# Altium schematic sheet Control_Moway.SchDoc: Control Moway
size A3; Revision: V2; SheetNumber: 2; SheetTotal: 3
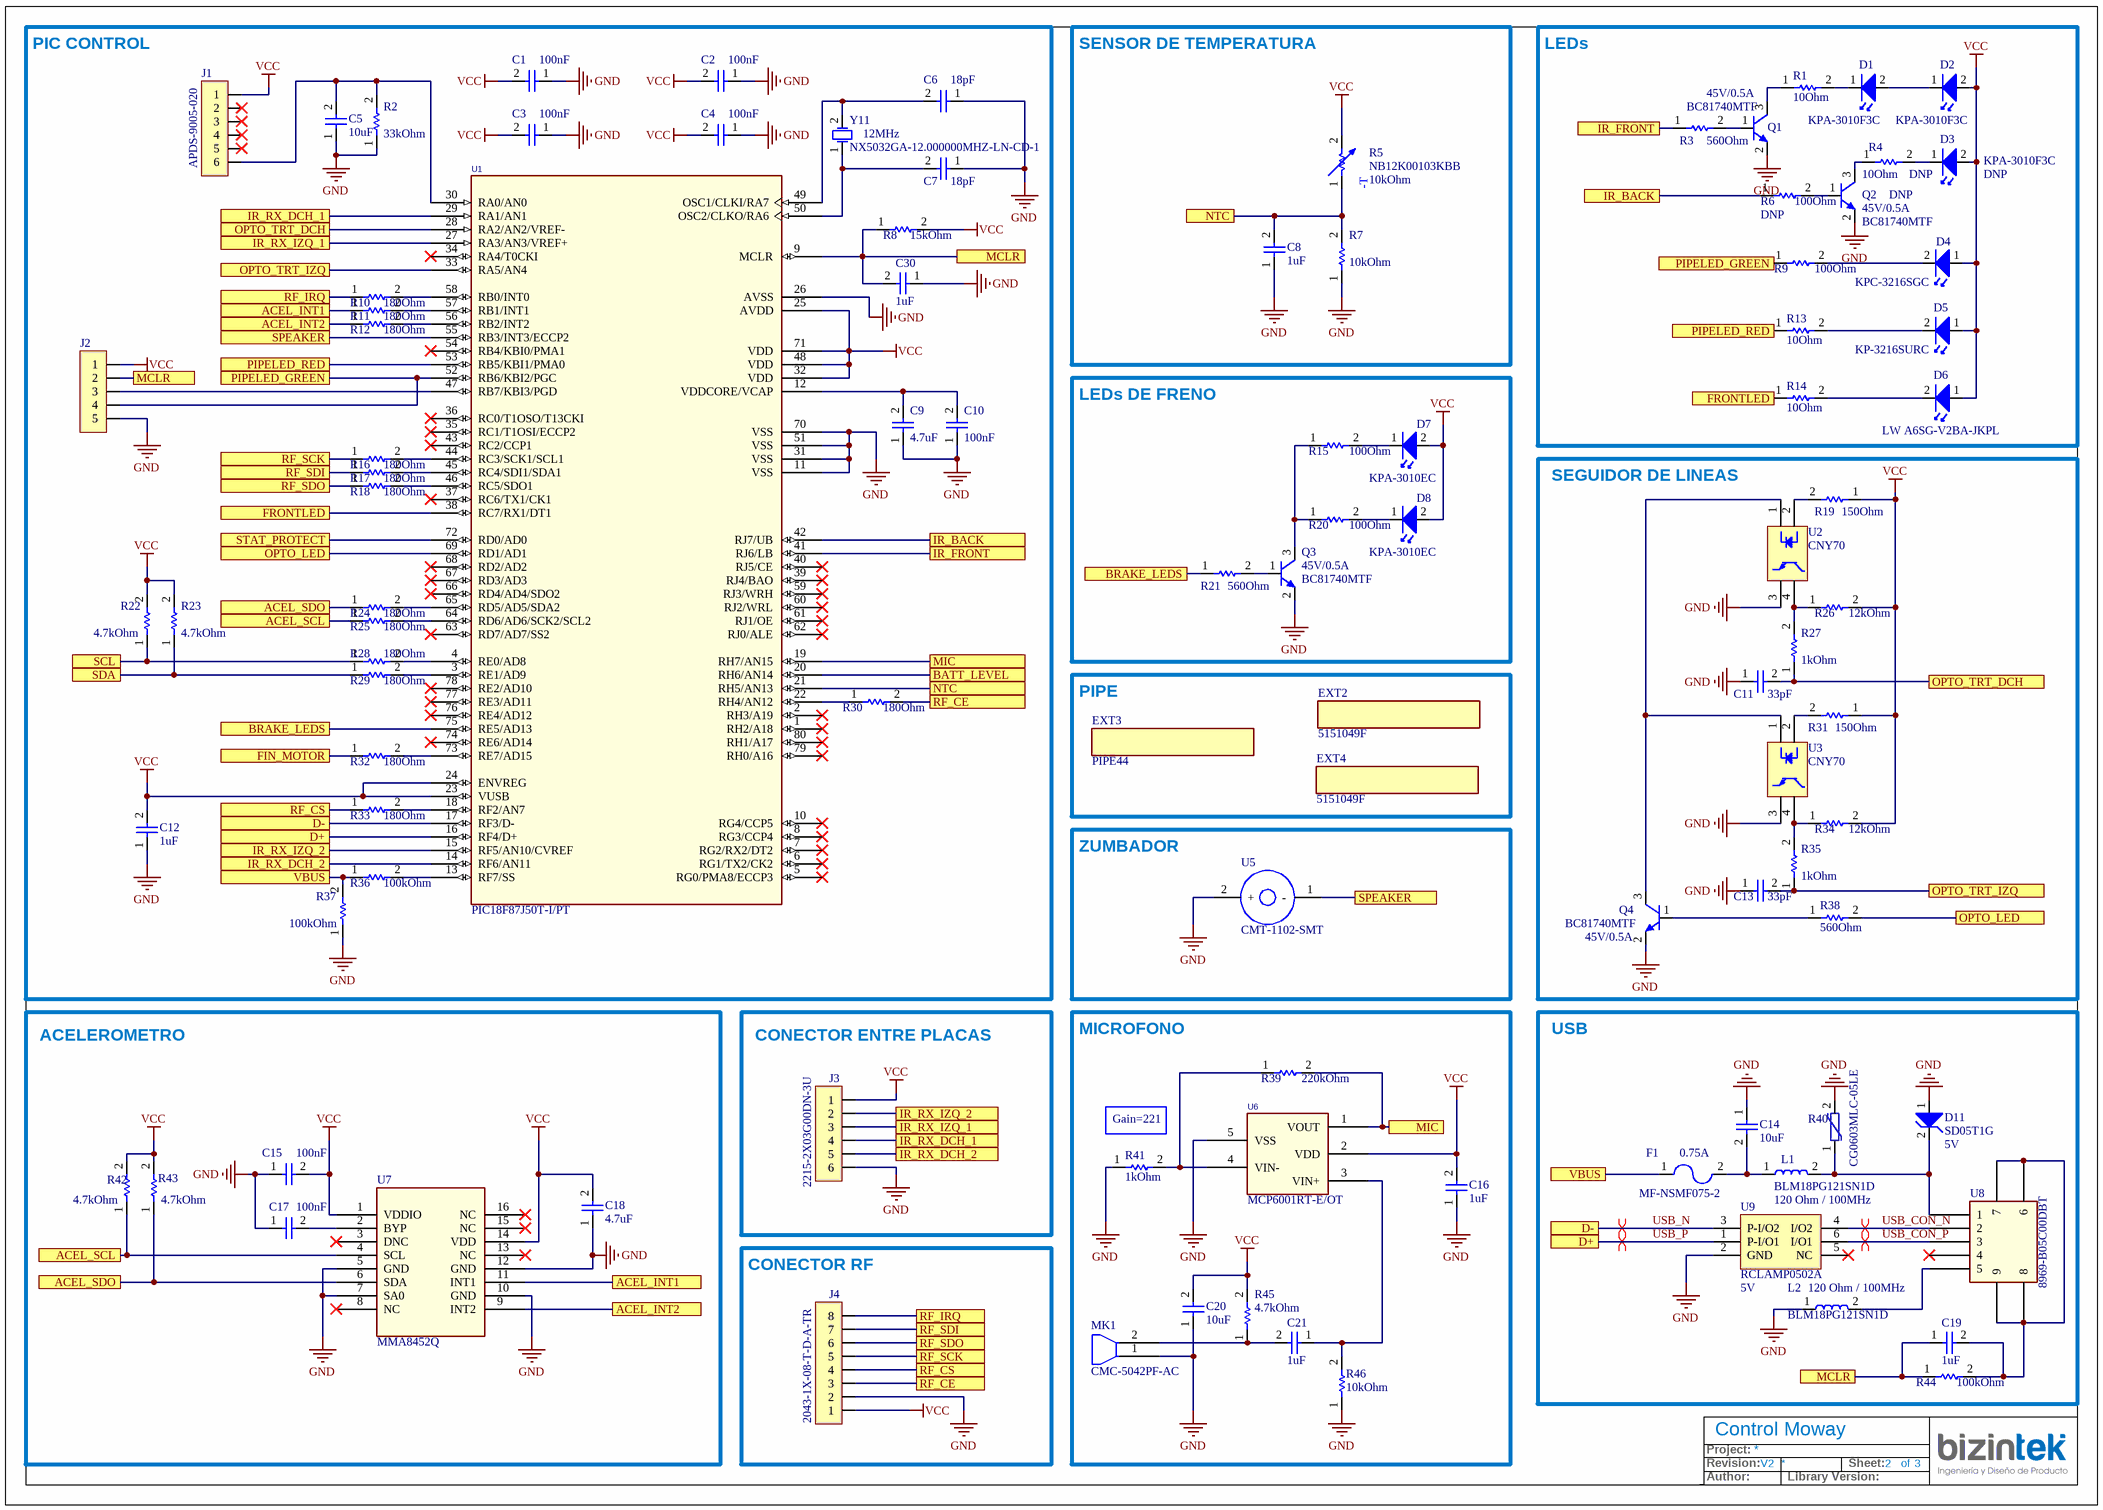
[diagram p0: Control_Moway.SchDoc]

## Parts
C1  value 100nF  [C0402]  (hidden comment: C100NV10X7R0402)
C2  value 100nF  [C0402]  (hidden comment: C100NV10X7R0402)
C3  value 100nF  [C0402]  (hidden comment: C100NV10X7R0402)
C4  value 100nF  [C0402]  (hidden comment: C100NV10X7R0402)
C5  value 10uF  [C0603]  (hidden comment: C10UV10X5R0603)
C6  value 18pF  [C0402]  (hidden comment: C18PV10C0G0402)
C7  value 18pF  [C0402]  (hidden comment: C18PV10C0G0402)
C8  value 1uF  [C0402]  (hidden comment: C1UV10X5R0402)
C9  value 4.7uF  [C0402]  (hidden comment: C4U7V10X5R0402)
C10  value 100nF  [C0402]  (hidden comment: C100NV10X7R0402)
C11  value 33pF  [C0603]  (hidden comment: C33PV10C0G0603)
C12  value 1uF  [C0402]  (hidden comment: C1UV10X5R0402)
C13  value 33pF  [C0603]  (hidden comment: C33PV10C0G0603)
C14  value 10uF  [C0603]  (hidden comment: C10UV10X5R0603)
C15  value 100nF  [C0402]  (hidden comment: C100NV10X7R0402)
C16  value 1uF  [C0402]  (hidden comment: C1UV10X5R0402)
C17  value 100nF  [C0402]  (hidden comment: C100NV10X7R0402)
C18  value 4.7uF  [C0402]  (hidden comment: C4U7V10X5R0402)
C19  value 1uF  [C0402]  (hidden comment: C1UV10X5R0402)
C20  value 10uF  [C0603]  (hidden comment: C10UV10X5R0603)
C21  value 1uF  [C0402]  (hidden comment: C1UV10X5R0402)
C30  value 1uF  [C0402]  (hidden comment: C1UV10X5R0402)
D1  Manufacturer Part Number: KPA-3010F3C  [KPA3010]  (hidden comment: KPA3010F3C)
D2  Manufacturer Part Number: KPA-3010F3C  [KPA3010]  (hidden comment: KPA3010F3C)
D3  DNP  Manufacturer Part Number: KPA-3010F3C  [KPA3010F3C_MOWAY]
D4  Manufacturer Part Number: KPC-3216SGC  [LED1206G]  (hidden comment: KPC3216SGC)
D5  Manufacturer Part Number: KP-3216SURC  [LED1206]  (hidden comment: KP3216SURC)
D6  Manufacturer Part Number: LW A6SG-V2BA-JKPL  [LWA6SG]  (hidden comment: LWA6SGV2BAJKPL)
D7  Manufacturer Part Number: KPA-3010EC  [KPA3010]  (hidden comment: KPA3010EC)
D8  Manufacturer Part Number: KPA-3010EC  [KPA3010]  (hidden comment: KPA3010EC)
D11  value 5V  [SOD323_ONSEMI]  (hidden comment: SD05T1G)
EXT2  5151049F  [5151049F]
EXT3  PIPE44  [PIPE44_MR]
EXT4  5151049F  [5151049F]
F1  value 0.75A  Manufacturer Part Number: MF-NSMF075-2  [F1206]  (hidden comment: MFNSMF0752)
J1  Manufacturer Part Number: APDS-9005-020  [APDS9005020]  (hidden comment: APDS9005020)
J2  PAD_5PIN_TH_2X1MM_1.5MM_PITCH  [PAD_5PIN_TH_2X1MM_1.5MM_PITCH]  (value not drawn)  (no BOM)
J3  Manufacturer Part Number: 2215-2X03G00DN-3U  [22152X03_OUPIIN]  (hidden comment: 2215203G00DN3U)
J4  Manufacturer Part Number: 2043-1X-08-T-D-A-TR  [20431X08TDATR_OUPIIN]  (hidden comment: 20431X08TDATR)
L1  value 120 Ohm / 100MHz  [L0603]  (hidden comment: BLM18PG121SN1D)
L2  value 120 Ohm / 100MHz  [L0603]  (hidden comment: BLM18PG121SN1D)
MK1  Manufacturer Part Number: CMC-5042PF-AC  [CMC5042PFAC]  (hidden comment: CMC5042PFAC)
Q1  value 45V/0.5A  [SOT23_FAIRCHILD]  (hidden comment: BC81740MTF)
Q2  DNP  value 45V/0.5A  Manufacturer Part Number: BC81740MTF  [SOT23_FAIRCHILD]
Q3  value 45V/0.5A  [SOT23_FAIRCHILD]  (hidden comment: BC81740MTF)
Q4  value 45V/0.5A  [SOT23_FAIRCHILD]  (hidden comment: BC81740MTF)
R1  value 10Ohm  [R0402]  (hidden comment: R10T10402)
R2  value 33kOhm  [R0402]  (hidden comment: R33KT10402)
R3  value 560Ohm  [R0402]  (hidden comment: R560T10402)
R4  DNP  value 10Ohm  [R0402]
R5  value 10kOhm  [R0805]  (hidden comment: NB12K00103KBB)
R6  DNP  value 100Ohm  [R0402]
R7  value 10kOhm  [R0402]  (hidden comment: R10KT10402)
R8  value 15kOhm  [R0402]  (hidden comment: R15KT10402)
R9  value 100Ohm  [R0402]  (hidden comment: R100T10402)
R10  value 180Ohm  [R0402]  (hidden comment: R180T10402)
R11  value 180Ohm  [R0402]  (hidden comment: R180T10402)
R12  value 180Ohm  [R0402]  (hidden comment: R180T10402)
R13  value 10Ohm  [R0402]  (hidden comment: R10T10402)
R14  value 10Ohm  [R0402]  (hidden comment: R10T10402)
R15  value 100Ohm  [R0402]  (hidden comment: R100T10402)
R16  value 180Ohm  [R0402]  (hidden comment: R180T10402)
R17  value 180Ohm  [R0402]  (hidden comment: R180T10402)
R18  value 180Ohm  [R0402]  (hidden comment: R180T10402)
R19  value 150Ohm  [R0402]  (hidden comment: R150T10402)
R20  value 100Ohm  [R0402]  (hidden comment: R100T10402)
R21  value 560Ohm  [R0402]  (hidden comment: R560T10402)
R22  value 4.7kOhm  [R0402]  (hidden comment: R4K7T10402)
R23  value 4.7kOhm  [R0402]  (hidden comment: R4K7T10402)
R24  value 180Ohm  [R0402]  (hidden comment: R180T10402)
R25  value 180Ohm  [R0402]  (hidden comment: R180T10402)
R26  value 12kOhm  [R0402]  (hidden comment: R12KT10402)
R27  value 1kOhm  [R0402]  (hidden comment: R1KT10402)
R28  value 180Ohm  [R0402]  (hidden comment: R180T10402)
R29  value 180Ohm  [R0402]  (hidden comment: R180T10402)
R30  value 180Ohm  [R0402]  (hidden comment: R180T10402)
R31  value 150Ohm  [R0402]  (hidden comment: R150T10402)
R32  value 180Ohm  [R0402]  (hidden comment: R180T10402)
R33  value 180Ohm  [R0402]  (hidden comment: R180T10402)
R34  value 12kOhm  [R0402]  (hidden comment: R12KT10402)
R35  value 1kOhm  [R0402]  (hidden comment: R1KT10402)
R36  value 100kOhm  [R0402]  (hidden comment: R100KT10402)
R37  value 100kOhm  [R0402]  (hidden comment: R100KT10402)
R38  value 560Ohm  [R0402]  (hidden comment: R560T10402)
R39  value 220kOhm  [R0402]  (hidden comment: R220KT10402)
R40  Manufacturer Part Number: CG0603MLC-05LE  [V0603]  (hidden comment: CG0603MLC05LE)
R41  value 1kOhm  [R0402]  (hidden comment: R1KT10402)
R42  value 4.7kOhm  [R0402]  (hidden comment: R4K7T10402)
R43  value 4.7kOhm  [R0402]  (hidden comment: R4K7T10402)
R44  value 100kOhm  [R0402]  (hidden comment: R100KT10402)
R45  value 4.7kOhm  [R0402]  (hidden comment: R4K7T10402)
R46  value 10kOhm  [R0402]  (hidden comment: R10KT10402)
U1  Manufacturer Part Number: PIC18F87J50T-I/PT  [TQFP80_MCP]  (hidden comment: PIC18F87J50TIPT)
U2  CNY70
U3  CNY70
U5  Manufacturer Part Number: CMT-1102-SMT  [CMT1102SMT]  (hidden comment: CMT1102SMT)
U6  Manufacturer Part Number: MCP6001RT-E/OT  [SOT23-5_MCP]  (hidden comment: MCP6001RTEOT)
U7  MMA8452Q  [QFN16-5x3_NXP]
U8  Manufacturer Part Number: 8969-B05C00DBT  [8969B05C00DBT_OUPIIN]  (hidden comment: 8969B05C00DBT)
U9  value 5V  [SOT666_SEMTECH]  (hidden comment: RCLAMP0502A)
Y11  value 12MHz  Manufacturer Part Number: NX5032GA-12.000000MHZ-LN-CD-1  [NX5032GA_NDK]  (hidden comment: NX5032GA12MHZLNCD1)

## Blocks framed on the sheet
PIC CONTROL: C1-C7 C9 C10 C12 C30 J1 J2 R2 R8 R10-R12 R16-R18 R22-R25 R28-R30 R32 R33 R36 R37 U1 Y11
SENSOR DE TEMPERATURA: C8 R5 R7
LEDs: D1-D6 Q1 Q2 R1 R3 R4 R6 R9 R13 R14
LEDs DE FRENO: D7 D8 Q3 R15 R20 R21
SEGUIDOR DE LINEAS: C11 C13 Q4 R19 R26 R27 R31 R34 R35 R38 U2 U3
PIPE: EXT2-EXT4
ZUMBADOR: U5
ACELEROMETRO: C15 C17 C18 R42 R43 U7
CONECTOR ENTRE PLACAS: J3
MICROFONO: C16 C20 C21 MK1 R39 R41 R45 R46 U6
USB: C14 C19 D11 F1 L1 L2 R40 R44 U8 U9
CONECTOR RF: J4

## Ports
ACEL_INT1, ACEL_INT2, ACEL_SCL, ACEL_SDO, BATT_LEVEL, BRAKE_LEDS, D+, D-, FIN_MOTOR, FRONTLED, IR_BACK, IR_FRONT, IR_RX_DCH_1, IR_RX_DCH_2, IR_RX_IZQ_1, IR_RX_IZQ_2, MCLR, MIC, NTC, OPTO_LED, OPTO_TRT_DCH, OPTO_TRT_IZQ, PIPELED_GREEN, PIPELED_RED, RF_CE, RF_CS, RF_IRQ, RF_SCK, RF_SDI, RF_SDO, SCL, SDA, SPEAKER, STAT_PROTECT, VBUS

## Nets
GND: C1.1 C2.1 C3.1 C4.1 C5.1 C6.1 C7.1 C8.1 C9.1 C10.1 C11.1 C12.1 C13.1 C14.1 C15.1 C16.1 C17.1 C18.1 C20.1 C30.1 D11.1(A) J2.5 J3.6 J4.2 L2.1 MK1.1 Q1.2(E) Q2.2(E) Q3.2(E) Q4.2(E) R2.1 R7.1 R37.1 R40.2 R41.1 R46.1 U1.11(VSS) U1.26(AVSS) U1.31(VSS) U1.51(VSS) U1.70(VSS) U2.3(S') U3.3(S') U5.2(+) U6.5(VSS) U7.5(GND) U7.7(SA0) U7.10(GND) U7.12(GND) U9.2(GND)
VCC: C1.2 C2.2 C3.2 C4.2 C12.2 C15.2 C16.2 C18.2 C20.2 D2.2(A) D3.2(A) D4.1(A) D5.1(A) D6.1(A) D7.2(A) D8.2(A) J1.1 J2.1 J3.1 J4.1 R5.2 R8.2 R19.1 R22.2 R23.2 R26.2 R31.1 R34.2 R42.2 R43.2 R45.2 U1.23(VUSB) U1.24(ENVREG) U1.25(AVDD) U1.32(VDD) U1.48(VDD) U1.71(VDD) U6.2(VDD) U7.1(VDDIO) U7.14(VDD)
ACEL_INT1: R11.1 U7.11(INT1) ; port ACEL_INT1
ACEL_INT2: R12.1 U7.9(INT2) ; port ACEL_INT2
ACEL_SCL: R25.1 R42.1 U7.4(SCL) ; port ACEL_SCL
ACEL_SDO: R24.1 R43.1 U7.6(SDA) ; port ACEL_SDO
BATT_LEVEL: U1.20(RH6/AN14) ; port BATT_LEVEL
BRAKE_LEDS: R21.1 U1.75(RE5/AD13) ; port BRAKE_LEDS
FIN_MOTOR: R32.1 ; port FIN_MOTOR
FRONTLED: R14.1 U1.38(RC7/RX1/DT1) ; port FRONTLED
IR_BACK: R6.1 U1.42(RJ7/UB) ; port IR_BACK
IR_FRONT: R3.1 U1.41(RJ6/LB) ; port IR_FRONT
IR_RX_DCH_1: J3.4 U1.29(RA1/AN1) ; port IR_RX_DCH_1
IR_RX_DCH_2: J3.5 U1.14(RF6/AN11) ; port IR_RX_DCH_2
IR_RX_IZQ_1: J3.3 U1.27(RA3/AN3/VREF+) ; port IR_RX_IZQ_1
IR_RX_IZQ_2: J3.2 U1.15(RF5/AN10/CVREF) ; port IR_RX_IZQ_2
MCLR: C19.1 C30.2 J2.2 R8.1 R44.1 U1.9(MCLR) ; port MCLR
MIC: R39.2 U1.19(RH7/AN15) U6.1(VOUT) ; port MIC
NTC: C8.2 R5.1 R7.2 U1.21(RH5/AN13) ; port NTC
OPTO_LED: R38.2 U1.69(RD1/AD1) ; port OPTO_LED
OPTO_TRT_DCH: C11.2 R27.1 U1.28(RA2/AN2/VREF-) ; port OPTO_TRT_DCH
OPTO_TRT_IZQ: C13.2 R35.1 U1.33(RA5/AN4) ; port OPTO_TRT_IZQ
PIPELED_GREEN: J2.4 R9.1 U1.52(RB6/KBI2/PGC) ; port PIPELED_GREEN
PIPELED_RED: R13.1 U1.53(RB5/KBI1/PMA0) ; port PIPELED_RED
RF_CE: J4.3 R30.2 ; port RF_CE
RF_CS: J4.4 R33.1 ; port RF_CS
RF_IRQ: J4.8 R10.1 ; port RF_IRQ
RF_SCK: J4.5 R16.1 ; port RF_SCK
RF_SDI: J4.7 R17.1 ; port RF_SDI
RF_SDO: J4.6 R18.1 ; port RF_SDO
SCL: R22.1 R28.1 ; port SCL
SDA: R23.1 R29.1 ; port SDA
SPEAKER: U1.55(RB3/INT3/ECCP2) U5.1(-) ; port SPEAKER
STAT_PROTECT: U1.72(RD0/AD0) ; port STAT_PROTECT
USB_CON_N: U8.2 U9.4(I/O2)
USB_CON_P: U8.3 U9.6(I/O1)
USB_N: U1.17(RF3/D-) U9.3(P-I/O2) ; port D-
USB_P: U1.16(RF4/D+) U9.1(P-I/O1) ; port D+
VBUS: F1.1 R36.1 R37.2 ; port VBUS
NetC5_2: C5.2 J1.6 R2.2 U1.30(RA0/AN0)
NetC6_2: C6.2 U1.49(OSC1/CLKI/RA7) Y11.2(OSC2)
NetC7_2: C7.2 U1.50(OSC2/CLKO/RA6) Y11.1(OSC1)
NetC9_2: C9.2 C10.2 U1.12(VDDCORE/VCAP)
NetC14_2: C14.2 F1.2 L1.1
NetC17_2: C17.2 U7.2(BYP)
NetC19_2: C19.2 R44.2 U8.6 U8.7 U8.8 U8.9
NetC21_1: C21.1 R46.2 U6.3(VIN+)
NetC21_2: C21.2 MK1.2 R45.1
NetD1_1: D1.1(K) R1.2
NetD1_2: D1.2(A) D2.1(K)
NetD3_1: D3.1(K) R4.2
NetD4_2: D4.2(K) R9.2
NetD5_2: D5.2(K) R13.2
NetD6_2: D6.2(K) R14.2
NetD7_1: D7.1(K) R15.2
NetD8_1: D8.1(K) R20.2
NetD11_2: D11.2 L1.2 R40.1 U8.1
NetJ2_3: J2.3 U1.47(RB7/KBI3/PGD)
NetL2_2: L2.2 U8.5
NetQ1_1: Q1.1(B) R3.2
NetQ1_3: Q1.3(C) R1.1
NetQ2_1: Q2.1(B) R6.2
NetQ2_3: Q2.3(C) R4.1
NetQ3_1: Q3.1(B) R21.2
NetQ3_3: Q3.3(C) R15.1 R20.1
NetQ4_1: Q4.1(B) R38.1
NetQ4_3: Q4.3(C) U2.1(LEDA) U3.1(LEDA)
NetR10_2: R10.2 U1.58(RB0/INT0)
NetR11_2: R11.2 U1.57(RB1/INT1)
NetR12_2: R12.2 U1.56(RB2/INT2)
NetR16_2: R16.2 U1.44(RC3/SCK1/SCL1)
NetR17_2: R17.2 U1.45(RC4/SDI1/SDA1)
NetR18_2: R18.2 U1.46(RC5/SDO1)
NetR19_2: R19.2 U2.2
NetR24_2: R24.2 U1.65(RD5/AD5/SDA2)
NetR25_2: R25.2 U1.64(RD6/AD6/SCK2/SCL2)
NetR26_1: R26.1 R27.2 U2.4
NetR28_2: R28.2 U1.4(RE0/AD8)
NetR29_2: R29.2 U1.3(RE1/AD9)
NetR30_1: R30.1 U1.22(RH4/AN12)
NetR31_2: R31.2 U3.2
NetR32_2: R32.2 U1.73(RE7/AD15)
NetR33_2: R33.2 U1.18(RF2/AN7)
NetR34_1: R34.1 R35.2 U3.4
NetR36_2: R36.2 U1.13(RF7/SS)
NetR39_1: R39.1 R41.2 U6.4(VIN-)

Not connected (* = marked no-connect by the designer): J1 2* 3* 4* 5*; U1 1(RH2/A18)* 2(RH3/A19)* 5(RG0/PMA8/ECCP3)* 6(RG1/TX2/CK2)* 7(RG2/RX2/DT2)* 8(RG3/CCP4)* 10(RG4/CCP5)* 34(RA4/T0CKI)* 35(RC1/T1OSI/ECCP2)* 36(RC0/T1OSO/T13CKI)* 37(RC6/TX1/CK1)* 39(RJ4/BAO)* 40(RJ5/CE)* 43(RC2/CCP1)* 54(RB4/KBI0/PMA1)* 59(RJ3/WRH)* 60(RJ2/WRL)* 61(RJ1/OE)* 62(RJ0/ALE)* 63(RD7/AD7/SS2)* 66(RD4/AD4/SDO2)* 67(RD3/AD3)* 68(RD2/AD2)* 74(RE6/AD14)* 76(RE4/AD12)* 77(RE3/AD11)* 78(RE2/AD10)* 79(RH0/A16)* 80(RH1/A17)*; U7 3(DNC)* 8(NC)* 13(NC)* 15(NC)* 16(NC)*; U8 4*; U9 5(NC)*

## Layout directives
differential pair: USB_CON_N, USB_CON_P, USB_N, USB_P

## Notes on the sheet
- (near R41) Gain=221
- Project:
- Revision:
- Author:
- Library Version:
- Sheet:
- of
- (in symbol NB12K00103KBB) -T

## Library data of the parts
C1-C4 C10 C15 C17 = C100NV10X7R0402: CAPACITOR SMD 0402, 100nF, 10V, X7R; Voltage: 10; Type: Passive/Capacitor; Part Number: C100NV10X7R0402; Dielectric: X7R
C5 C14 C20 = C10UV10X5R0603: CAPACITOR SMD 0603, 10uF, 10V, X5R; Voltage: 10; Type: Passive/Capacitor; Part Number: C10UV10X5R0603; Dielectric: X5R
C6 C7 = C18PV10C0G0402: CAPACITOR SMD 0402, 18pF, 10V, C0G; Type: Passive/Capacitor; Part Number: C18PV10C0G0402; Dielectric: C0G
C8 C12 C16 C19 C21 C30 = C1UV10X5R0402: CAPACITOR SMD 0402, 1uF, 10V, X5R; Type: Passive/Capacitor; Part Number: C1UV10X5R0402; Dielectric: X5R
C9 C18 = C4U7V10X5R0402: CAPACITOR SMD 0402, 4.7uF, 10V, X5R; Voltage: 10; Type: Passive/Capacitor; Part Number: C4U7V10X5R0402; Dielectric: X5R
C11 C13 = C33PV10C0G0603: CAPACITOR SMD 0603, 33pF, 10V, C0G; Type: Passive/Capacitor; Part Number: C33PV10C0G0603; Dielectric: C0G
D1 D2 = KPA3010F3C: IR-LED, SMD, 3mm x 2mm x 1 mm, 1,2V, 20mA, 940nm; Manufacturer: KINGBRIGHT; Type: LED; Part Number: KPA3010F3C; Supplier 1: Farnell; Supplier Part Number 1: 2426200; Supplier 2: RS; Supplier Part Number 2: 862-4705; Datasheet MPN 1: http://datasheet.octopart.com/KPA-3010F3C-Kingbright-datasheet-83958251.pdf
D3 = KPA3010F3C_MOWAY: IR-LED, SMD, 3mm x 2mm x 1 mm, 1,2V, 20mA, 940nm; Manufacturer: KINGBRIGHT; Type: LED; Part Number: KPA3010F3C_MOWAY; Supplier 1: Farnell; Supplier Part Number 1: 2426200; Supplier 2: RS; Supplier Part Number 2: 862-4705; Datasheet MPN 1: http://datasheet.octopart.com/KPA-3010F3C-Kingbright-datasheet-83958251.pdf
D4 = KPC3216SGC: LED, Low Power, Green, SMD, 1.6mm x 2mm, 20mA, 2.2V, 568nm; Manufacturer: KINGBRIGHT; Part Number: KPC3216SGC; Supplier 1: Farnell; Supplier Part Number 1: 1318254; Supplier 2: RS; Supplier Part Number 2: 466-3908; Type: LED; Datasheet MPN 1: http://datasheet.octopart.com/KPC-3216SGC-Kingbright-datasheet-33027990.pdf
D5 = KP3216SURC: LED, Low Power, Red, SMD, 20 mA, 1.9 V, 628 nm; Manufacturer: KINGBRIGHT; Part Number: KP3216SURC; Supplier 1: Farnell; Supplier Part Number 1: 8530017; Supplier 2: RS; Supplier Part Number 2: 466-3920; Type: LED; Datasheet MPN 1: http://datasheet.octopart.com/KP-3216SURC-Kingbright-datasheet-17932066.pdf
D6 = LWA6SGV2BAJKPL: LED Osram Opto, White, 4.5 lm, 5600K, 3.2 V, 120°, SIDELED serie; Part Number: LWA6SGV2BAJKPL; Manufacturer: OSRAM; Supplier 1: Mouser; Supplier Part Number 1: 720-LWA6SGV2BAJKPLZI; Supplier 2: RS; Supplier Part Number 2: 688-9578; Type: LED; Datasheet MPN 1: http://datasheet.octopart.com/Q65110A8994-Osram-datasheet-13697590.pdf
D7 D8 = KPA3010EC: LED, Right Angle, Red, SMD, 20mA, 2V, 617nm; Manufacturer: KINGBRIGHT; Part Number: KPA3010EC; Supplier 1: Farnell; Supplier Part Number 1: 8530327; Supplier 2: RS; Supplier Part Number 2: 862-4695; Type: LED; Datasheet MPN 1: http://datasheet.octopart.com/KPA-3010EC-Kingbright-datasheet-62316490.pdf
D11 = SD05T1G: TVS Diode, SD05T1 Series, Unidirectional, 5 V, 14.5 V, SOD-323, 2 Pins; Manufacturer: ON SEMICONDUCTOR; Voltage: 5; Revisado Ing: OK; Part Number: SD05T1G; Manufacturer Part Number: SD05T1G; Supplier 1: Farnell; Supplier Part Number 1: 2463641; Supplier 2: Mouser; Supplier Part Number 2: 863-SD05T1G; Type: Diode; Datasheet MPN 1: http://datasheet.octopart.com/SD05T1G-ON-Semiconductor-datasheet-163639.pdf
EXT2 EXT4 = 5151049F: LIGHT PIPE; Manufacturer: DIALIGHT; Part Number: 5151049F; Manufacturer Part Number: 5151049F; Supplier 1: Digikey; Supplier Part Number 1: 350-2175-ND; Supplier 2: Mouser; Supplier Part Number 2: 645-515-1049F; Type: LED; Datasheet MPN 1: http://datasheet.octopart.com/515-1049F-Dialight-datasheet-8325321.pdf
EXT3 = PIPE44: Light Pipe; Manufacturer: MINIROBOTS; Part Number: PIPE44; Manufacturer Part Number: PIPE44; Type: LED
F1 = MFNSMF0752: PPTC Resettable Fuse, SMD, MF-NSMF Series, 750 mA, 1.5 A, 6 V, -40 °C; Manufacturer: BOURNS; Current: 0.75; Part Number: MFNSMF0752; Supplier 1: Digikey; Supplier Part Number 1: MF-NSMF075-2CT-ND; Supplier 2: Mouser; Supplier Part Number 2: 652-MF-NSMF075-2; Type: Fuse; Datasheet MPN 1: http://datasheet.octopart.com/MF-NSMF075-2-Bourns-datasheet-62292265.pdf
J1 = APDS9005020: Ambient Light Photosensor, APDS-9005, Miniature, SMD, chipLED, Analogue, 1.8 V to 5.5 V; Manufacturer: AVAGO; Part Number: APDS9005020; Supplier 1: Mouser; Supplier Part Number 1: 630-APDS-9005-020; Supplier 2: Digikey; Supplier Part Number 2: 516-1717-1-ND; Type: Interface; Datasheet MPN 1: http://datasheet.octopart.com/APDS-9005-020-Avago-datasheet-26352816.pdf
J3 = 2215203G00DN3U: Board to Board connector, SMD, 6 pin, 1.27 pitch; Manufacturer: OUPIIN; Part Number: 2215203G00DN3U; Supplier 1: MATRIX; Supplier Part Number 1: 2215-2*03G00DN/3U; Type: Connector
J4 = 20431X08TDATR: Expansion Connector, 8 pin, SMD Female; Manufacturer: OUPIIN; Part Number: 20431X08TDATR; Supplier 1: MATRIX; Supplier Part Number 1: 2043-1X-08-T-D-A-TR; Type: Connector; Datasheet MPN 1: http://oupiin.com/technology_ii.html?tit=2043-1&gID=26
L1 L2 = BLM18PG121SN1D: INDUCTOR SMD 120 Ohm / 100MHz, 2A, 0603; Manufacturer: MURATA; Current: 2; Type: Passive/Inductor; Revisado Ing: OK; Part Number: BLM18PG121SN1D; Manufacturer Part Number: BLM18PG121SN1D; Supplier 1: Digikey; Supplier Part Number 1: 490-1037-1-ND; Supplier 2: Mouser; Supplier Part Number 2: 81-BLM18PG121SN1D; Datasheet MPN 1: http://datasheet.octopart.com/BLM18PG121SN1D-Murata-datasheet-78375072.pdf
MK1 = CMC5042PFAC: Electret Condenser Microphone; Manufacturer: CUI; Part Number: CMC5042PFAC; Supplier 1: Digikey; Supplier Part Number 1: 102-1724-ND; Supplier 2: Mouser; Supplier Part Number 2: 490-CMC-5042PF-AC; Type: Interface; Datasheet MPN 1: http://datasheet.octopart.com/CMC-5042PF-AC-CUI-datasheet-15695903.pdf
Q1-Q4 = BC81740MTF: Bipolar (BJT) Single Transistor, NPN, 45 V, 170 MHz, 300 mW, 500 mA, 250 hFE; Manufacturer: FAIRCHILD; Type: Transistor/BJT; Current: 0.5; Part Number: BC81740MTF; Supplier 1: Farnell; Supplier Part Number 1: 1798081; Supplier 2: Mouser; Supplier Part Number 2: 512-BC81740MTF; Datasheet MPN 1: http://datasheet.octopart.com/BC81740MTF-Fairchild-datasheet-56423.pdf
  Q1 Q3 Q4: Manufacturer Part Number: BC81740MTF
R1 R4 R13 R14 = R10T10402: RESISTOR SMD 0402, 10Ohm, 1%; Tolerance: 1; Part Number: R10T10402; Type: Passive/Resistor
R2 = R33KT10402: RESISTOR SMD 0402, 33kOhm, 1%; Tolerance: 1; Part Number: R33KT10402; Type: Passive/Resistor
R3 R21 R38 = R560T10402: RESISTOR SMD 0402, 560Ohm, 1%; Tolerance: 1; Part Number: R560T10402; Type: Passive/Resistor
R5 = NB12K00103KBB: Thermistor, NTC, 10 kohm, NB12 Series, 3630 K, SMD, 0805; Manufacturer: AVX; Part Number: NB12K00103KBB; Manufacturer Part Number: NB12K00103KBB; Supplier 1: Farnell; Supplier Part Number 1: 1672287; Supplier 2: Mouser; Supplier Part Number 2: 581-NB12K00103KBB; Type: Passive/NTC; Datasheet MPN 1: http://datasheet.octopart.com/NB12K00103KBB-AVX-datasheet-120348.pdf
R6 R9 R15 R20 = R100T10402: RESISTOR SMD 0402, 100Ohm, 1%; Tolerance: 1; Part Number: R100T10402; Type: Passive/Resistor
R7 R46 = R10KT10402: RESISTOR SMD 0402, 10kOhm, 1%; Tolerance: 1; Part Number: R10KT10402; Type: Passive/Resistor; Datasheet MPN 2: http://datasheet.octopart.com/CRCW040210K0FKED.-Vishay-datasheet-78776209.pdf; Manufacturer 2: VISHAY; Manufacturer Part Number 2: CRCW040210K0FKED; Supplier 1 -MPN 2: Digikey; Supplier 2 - MPN 2: Mouser; Supplier Part Number 1 - MPN 2: 541-10.0KLDKR-ND; Supplier Part Number 2 - MPN 2: CRCW040210K0FKED
R8 = R15KT10402: RESISTOR SMD 0402, 15kOhm, 1%; Tolerance: 1; Part Number: R15KT10402; Type: Passive/Resistor
R10-R12 R16-R18 R24 R25 R28-R30 R32 R33 = R180T10402: RESISTOR SMD 0402, 180Ohm, 1%; Tolerance: 1; Part Number: R180T10402; Type: Passive/Resistor
R19 R31 = R150T10402: RESISTOR SMD 0402, 150Ohm, 1%; Tolerance: 1; Part Number: R150T10402; Type: Passive/Resistor
R22 R23 R42 R43 R45 = R4K7T10402: RESISTOR SMD 0402, 4.7kOhm, 1%; Tolerance: 1; Part Number: R4K7T10402; Type: Passive/Resistor
R26 R34 = R12KT10402: RESISTOR SMD 0402, 12kOhm, 1%; Tolerance: 1; Part Number: R12KT10402; Type: Passive/Resistor
R27 R35 R41 = R1KT10402: RESISTOR SMD 0402, 1kOhm, 1%; Tolerance: 1; Part Number: R1KT10402; Type: Passive/Resistor
R36 R37 R44 = R100KT10402: RESISTOR SMD 0402, 100kOhm, 1%; Tolerance: 1; Part Number: R100KT10402; Type: Passive/Resistor
  R37 R44: Datasheet MPN 2: http://datasheet.octopart.com/CRCW0402100KFKED.-Vishay-datasheet-78776209.pdf; Manufacturer 2: VISHAY; Manufacturer Part Number 2: CRCW0402100KFKED; Supplier 1 -MPN 2: Digikey; Supplier 2 - MPN 2: Mouser; Supplier Part Number 1 - MPN 2: 541-100KLCT-ND; Supplier Part Number 2 - MPN 2: CRCW0402100KFKED
R39 = R220KT10402: RESISTOR SMD 0402, 220kOhm, 1%; Tolerance: 1; Part Number: R220KT10402; Type: Passive/Resistor
R40 = CG0603MLC05LE: Varistor SMD; Manufacturer: BOURNS; Part Number: CG0603MLC05LE; Supplier 1: Digikey; Supplier Part Number 1: CG0603MLC-05LECT-ND; Supplier 2: Mouser; Supplier Part Number 2: 652-CG0603MLC-05RE; Type: Varistor; Datasheet MPN 1: http://datasheet.octopart.com/CG0603MLC-05LE-Bourns-datasheet-80871568.pdf
U1 = PIC18F87J50TIPT: 80-pin 1-Mbit FLASH USB MCU; Manufacturer: MICROCHIP; Part Number: PIC18F87J50TIPT; Supplier 1: Digikey; Supplier Part Number 1: PIC18F87J50-I/PT-ND; Supplier 2: Mouser; Supplier Part Number 2: 579-PIC18F87J50-I/PT; Type: MCU; Datasheet MPN 1: http://datasheet.octopart.com/PIC18F87J50T-I/PT-Microchip-datasheet-8730512.pdf
U5 = CMT1102SMT: PIEZO BUZZER TRANSDUCER, 73dB a 5V  10cm; Manufacturer: CUI; Part Number: CMT1102SMT; Supplier 1: Digikey; Supplier Part Number 1: 102-1264-1-ND; Supplier 2: Mouser; Supplier Part Number 2: 490-CMT-1102-SMT-TR; Type: Interface; Datasheet MPN 1: http://datasheet.octopart.com/CMT-1102-SMT-TR-CUI-datasheet-93080523.pdf
U6 = MCP6001RTEOT: 1MHz Low-Power Op Amp; Manufacturer: MICROCHIP; Part Number: MCP6001RTEOT; Supplier 1: Digikey; Supplier Part Number 1: MCP6001RT-E/OTCT-ND; Supplier 2: Mouser; Supplier Part Number 2: 579-MCP6001RT-E/OT; Type: Operational Amplifier; Datasheet MPN 1: http://datasheet.octopart.com/MCP6001RT-I/OT-Microchip-datasheet-8823409.pdf
U7 = MMA8452Q: MEMS Accelerometer, 3-Axis, Digital, X, Y, Z, ± 2g, ± 4g, ± 8g, 1.95 V, 3.6 V, QFN; Manufacturer: NXP; Part Number: MMA8452Q; Manufacturer Part Number: MMA8452Q; Supplier 1: Mouser; Supplier Part Number 1: 841-MMA8452Q; Supplier 2: Farnell; Supplier Part Number 2: 1842360; Type: Accelerometer; Datasheet MPN 1: http://datasheet.octopart.com/MMA8452QT-Freescale-Semiconductor-datasheet-10031006.pdf
U8 = 8969B05C00DBT: USB Connector, Mini USB Type B, 5 Ways, SMD; Manufacturer: OUPIIN; Comments2: TBD; Part Number: 8969B05C00DBT; Supplier 1: MATRIX; Supplier Part Number 1: 8969-B05C00DBT; Type: Connector
U9 = RCLAMP0502A: TVS Diode, RailClamp Series, 5 V, 18 V, SOT-666, 6 Pins; Manufacturer: SEMTECH; Voltage: 5; Part Number: RCLAMP0502A; Manufacturer Part Number: RCLAMP0502A; Supplier 1: Digikey; Supplier Part Number 1: RCLAMP0502ACT-ND; Supplier 2: Mouser; Supplier Part Number 2: 947-RCLAMP0502A.TCT; Type: Diode; Datasheet MPN 1: http://datasheet.octopart.com/RCLAMP0502A.TCT-Semtech-datasheet-10675609.pdf
Y11 = NX5032GA12000000MHZLNCD1: Crystal, 12MHz, SMD, 5mm x 3.2mm, 8pF, 50ppm; Manufacturer: NDK; Part Number: NX5032GA12000000MHZLNCD1; Supplier 1: Digikey; Supplier Part Number 1: 644-1034-1-ND; Type: Crystal/Oscilator; Datasheet MPN 1: https://media.digikey.com/pdf/Data%20Sheets/NDK%20PDFs/NX5032GA.pdf
J2 = PAD_5PIN_TH_2X1MM_1.5MM_PITCH: Part Number: PAD_5PIN_TH_2X1MM_1.5MM_PITCH; Type: Miscellaneous